# EAGLE design module (EAGLE 9.6.2)
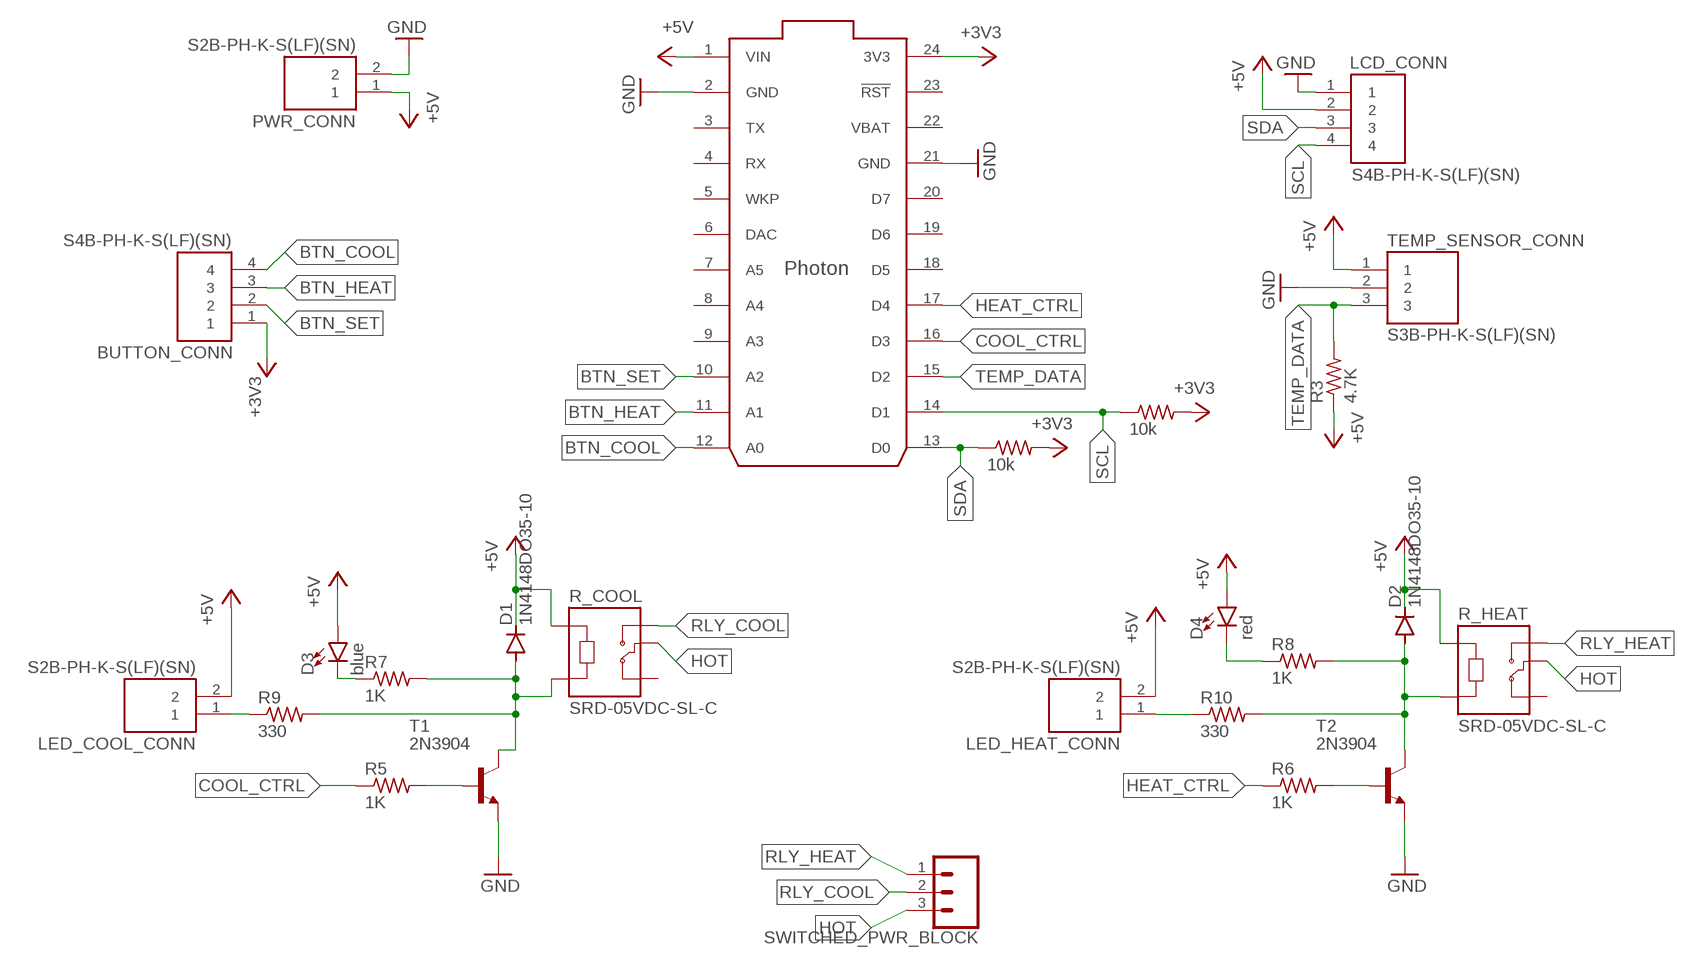
[diagram p0: schematic, sheet 1]

## Parts
BUTTON_CONN  S4B-PH-K-S(LF)(SN)  [JST_S4B-PH-K-S(LF)(SN)]
D1  1N4148DO35-10  [DO35-10]
D2  1N4148DO35-10  [DO35-10]
D3  blue  LED3MM  [LED_3MM]
D4  red  LED3MM  [LED_3MM]
LCD_CONN  S4B-PH-K-S(LF)(SN)  [JST_S4B-PH-K-S(LF)(SN)]
LED_COOL_CONN  S2B-PH-K-S(LF)(SN)  [JST_S2B-PH-K-S(LF)(SN)]
LED_HEAT_CONN  S2B-PH-K-S(LF)(SN)  [JST_S2B-PH-K-S(LF)(SN)]
PWR_CONN  S2B-PH-K-S(LF)(SN)  [JST_S2B-PH-K-S(LF)(SN)]
R1  10k  R-US_0207/10  [0207/10]
R2  10k  R-US_0207/10  [0207/10]
R3  4.7K  R-US_0207/10  [0207/10]
R5  1K  R-US_0207/10  [0207/10]
R6  1K  R-US_0207/10  [0207/10]
R7  1K  R-US_0207/10  [0207/10]
R8  1K  R-US_0207/10  [0207/10]
R9  330  R-US_0207/10  [0207/10]
R10  330  R-US_0207/10  [0207/10]
R_COOL  SRD-05VDC-SL-C  [RELAY_SRD-05VDC-SL-C]
R_HEAT  SRD-05VDC-SL-C  [RELAY_SRD-05VDC-SL-C]
SWITCHED_PWR_BLOCK  CONN_03-SCREW-5MM  [SCREWTERMINAL-5MM-3]
T1  2N3904  [TO92]
T2  2N3904  [TO92]
TEMP_SENSOR_CONN  S3B-PH-K-S(LF)(SN)  [JST_S3B-PH-K-S(LF)(SN)]
U$1  PHOTON_WITH_HEADERS  [PHOTON]

## Nets
+3V3: BUTTON_CONN.1 R1.2 R2.2 U$1.24(3V3)
+5V: D1.C D2.C D3.A D4.A LCD_CONN.2 LED_COOL_CONN.2 LED_HEAT_CONN.2 PWR_CONN.1 R3.1 R_COOL.A1 R_HEAT.A1 TEMP_SENSOR_CONN.1 U$1.1(VIN)
BTN_COOL: BUTTON_CONN.4 U$1.12(A0)
BTN_HEAT: BUTTON_CONN.3 U$1.11(A1)
BTN_SET: BUTTON_CONN.2 U$1.10(A2)
COOL_CTRL: R5.1 U$1.16(D3)
GND: LCD_CONN.1 PWR_CONN.2 T1.3(E) T2.3(E) TEMP_SENSOR_CONN.2 U$1.2(GND) U$1.21(GND)
HEAT_CTRL: R6.1 U$1.17(D4)
HOT [high_pwr]: R_COOL.COM R_HEAT.COM SWITCHED_PWR_BLOCK.3
N$2: LED_COOL_CONN.1 R9.1
N$3: LED_HEAT_CONN.1 R10.1
N$4: D1.A R7.2 R9.2 R_COOL.A2 T1.1(C)
N$5: D3.K(C) R7.1
N$6: R5.2 T1.2(B)
N$8: R6.2 T2.2(B)
N$9: D2.A R8.2 R10.2 R_HEAT.A2 T2.1(C)
N$13: D4.K(C) R8.1
RLY_COOL [high_pwr]: R_COOL.NO SWITCHED_PWR_BLOCK.2
RLY_HEAT [high_pwr]: R_HEAT.NO SWITCHED_PWR_BLOCK.1
SCL: LCD_CONN.4 R1.1 U$1.14(D1)
SDA: LCD_CONN.3 R2.1 U$1.13(D0)
TEMP_DATA: R3.2 TEMP_SENSOR_CONN.3 U$1.15(D2)
Unconnected: R_COOL.NC R_HEAT.NC U$1.3(TX) U$1.4(RX) U$1.5(WKP) U$1.6(DAC) U$1.7(A5) U$1.8(A4) U$1.9(A3) U$1.18(D5) U$1.19(D6) U$1.20(D7) U$1.23(!RST)

## Power pins joined to a net without a drawn wire
VBAT: U$1.22(VBAT)

## Library data of the parts
BUTTON_CONN LCD_CONN = S4B-PH-K-S_LF__SN_:S4B-PH-K-S(LF)(SN): PH Series 4 Position 2 mm Pitch Through Hole Side Entry Shrouded Header Check availability <https://pricing.snapeda.com/parts/S4B-PH-K-S%28LF%29%28SN%29/JST%20Sales/view-part?ref=eda>; AVAILABILITY: In Stock; DESCRIPTION: Connector Header Through Hole, Right Angle 4 position 0.079 (2.00mm); MF: JST (JAPAN SOLDERLESS TERMINALS); MP: S4B-PH-K-S(LF)(SN); MPN: S4B-PH-K-S (LF)(SN); OC_NEWARK: 38K8074; PACKAGE: None; PRICE: None
D1 D2 = diode:1N4148: DIODE high speed (Philips); MF: MULTICOMP PRO; MPN: 1N4148 (DO-35); OC_NEWARK: 05AC0533
D3 = SparkFun-LED:LED: LED (Generic) Standard schematic elements and footprints for 5mm, 3mm, 1206, and 0603 sized LEDs. Generic LEDs with no color specified.; MF: VISHAY; MPN: TLHB4400; OC_NEWARK: 09X0596; PROD_ID: DIO-08794
D4 = SparkFun-LED:LED: LED (Generic) Standard schematic elements and footprints for 5mm, 3mm, 1206, and 0603 sized LEDs. Generic LEDs with no color specified.; MF: VCC (VISUAL COMMUNICATIONS COMPANY); MPN: 4300F1LC; OC_NEWARK: 05C1482; PROD_ID: DIO-08794
LED_COOL_CONN LED_HEAT_CONN PWR_CONN = S2B-PH-K-S_LF__SN_:S2B-PH-K-S(LF)(SN): PH Series 2 Position 2.0 mm Through Hole Side Entry Shrouded Header Check availability <https://pricing.snapeda.com/parts/S2B-PH-K-S%28LF%29%28SN%29/JST%20Sales%20America%20Inc./view-part?ref=eda>; AVAILABILITY: In Stock; DESCRIPTION: Connector Header Through Hole, Right Angle 2 position; MF: JST (JAPAN SOLDERLESS TERMINALS); MP: S2B-PH-K-S(LF)(SN); MPN: S2B-PH-K-S (LF)(SN); OC_NEWARK: 38K8066; PACKAGE: None; PRICE: None
R1-R3 R5-R10 = rcl:R-US_: RESISTOR, American symbol; OC_NEWARK: unknown; SPICEPREFIX: R
R_COOL R_HEAT = SRD-05VDC-SL-C:SRD-05VDC-SL-C: 5V Trigger Relay Module For Arduino And Raspberry Pi 5V Trigger Relay Module For Arduino And Raspberry Pi Check availability <https://pricing.snapeda.com/parts/SRD-05VDC-SL-C/Songle%20Relay/view-part?ref=eda>; AVAILABILITY: Not in stock; DESCRIPTION: 5V Trigger Relay Module For Arduino And Raspberry Pi 5V Trigger Relay Module For Arduino And Raspberry Pi; MP: SRD-05VDC-SL-C; OC_NEWARK: unknown; PACKAGE: None; PRICE: None
SWITCHED_PWR_BLOCK = SparkFun-Connectors:CONN_03: Multi connection point. Often used as Generic Header-pin footprint for 0.1 inch spaced/style header connections On any of the 0.1 inch spaced packages, you can populate with these: Break Away Headers - Straight <https://www.sparkfun.com/products/116> (PRT-00116) Break Away Male Headers - Right Angle <https://www.sparkfun.com/products/553> (PRT-00553) Female Headers <https://www.sparkfun.com/products/115> (PRT-00115) Break Away Headers - Machine Pin <https://www.sparkfun.com/products/117> (PRT-00117) Break Away Female Headers - Swiss Machine Pin <https://www.sparkfun.com/products/743> (PRT-00743) Stackable Header - 3 Pin (Female, 0.1") <https://www.sparkfun.com/products/13875> (PRT-13875) For SCREWTERMINALS and SPRING TERMINALS visit here: Screw Terimnals on SparkFun.com <https://www.sparkfun.com/search/results?term=Screw+Terminals> (5mm/3.5mm/2.54mm spacing) This device is also useful as a general connection point to wire up your design to another part of your project. Our various solder wires solder well into these plated through hole pads. Hook-Up Wire - Assortment (Stranded, 22 AWG) <https://www.sparkfun.com/products/11375> (PRT-11375) Hook-Up Wire - Assortment (Solid Core, 22 AWG) <https://www.sparkfun.com/products/11367> (PRT-11367) View the entire wire category on our website here <https://www.sparkfun.com/categories/141> Special notes: Molex polarized connector foot print use with SKU : PRT-08232 with associated crimp pins and housings.; OC_NEWARK: unknown; PROD_ID: CONN-10134; SF_SKU: PRT-08433
T1 T2 = transistor:2N3904: NPN TRANSISTOR; MF: ONSEMI; MPN: 2N3904TF; OC_NEWARK: 05R0381
TEMP_SENSOR_CONN = S3B-PH-K-S_LF__SN_:S3B-PH-K-S(LF)(SN): Connector Header Through Hole, Right Angle 3 position 0.079" (2.00mm); DESCRIPTION: Connector Header Through Hole, Right Angle 3 position 0.079 (2.00mm); DIGI-KEY_PART_NUMBER: 455-1720-ND; MF: JST (JAPAN SOLDERLESS TERMINALS); MP: S3B-PH-K-S(LF)(SN); MPN: S3B-PH-K-S (LF)(SN); OC_NEWARK: 38K8070; PACKAGE: None
U$1 = Particle-Devices:PHOTON: Particle Photon Wi-Fi through-hole development board footprint Product datasheet: here <https://docs.particle.io/datasheets/photon-(wifi)/photon-datasheet/> Design files: here <https://github.com/particle-iot/photon> Github : Particle devices library <https://github.com/particle-iot/hardware-libraries/tree/master/Eagle>; MF: PARTICLE; MPN: PHOTONH; OC_NEWARK: 60AC3758

## Net classes
0 default: width 0.305 mm, drill 0.61 mm, clearance 0.254 mm
1 high_pwr: width 1.524 mm, drill 1.27 mm, clearance 1.016 mm

## Board
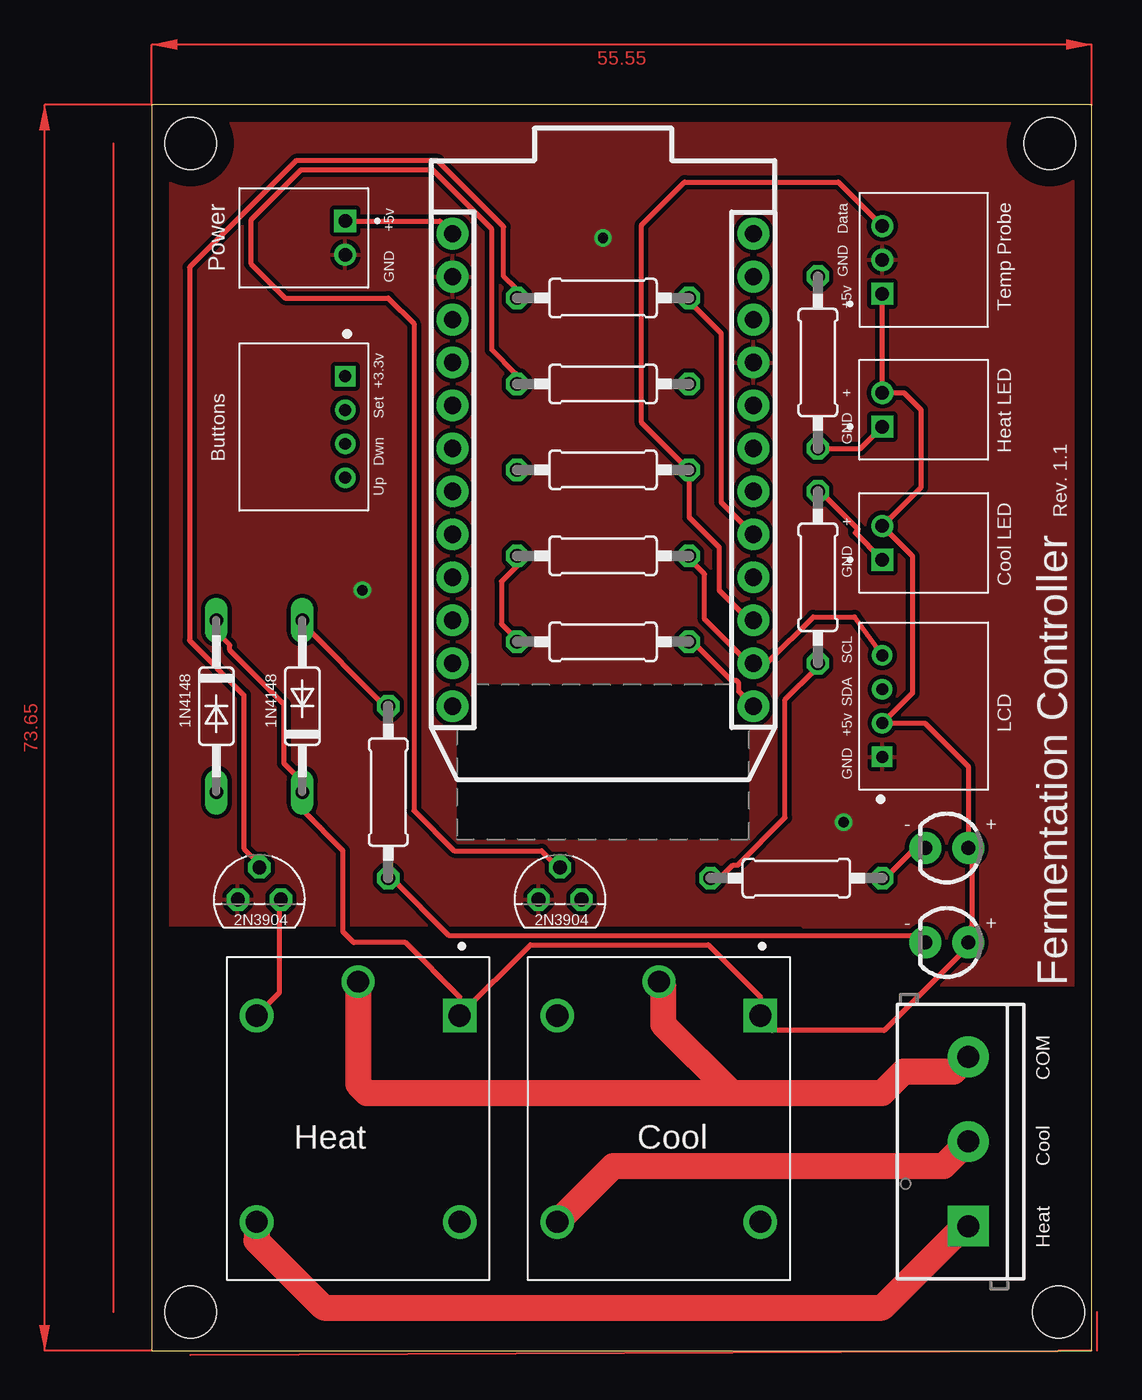
[diagram p1: board, top side]
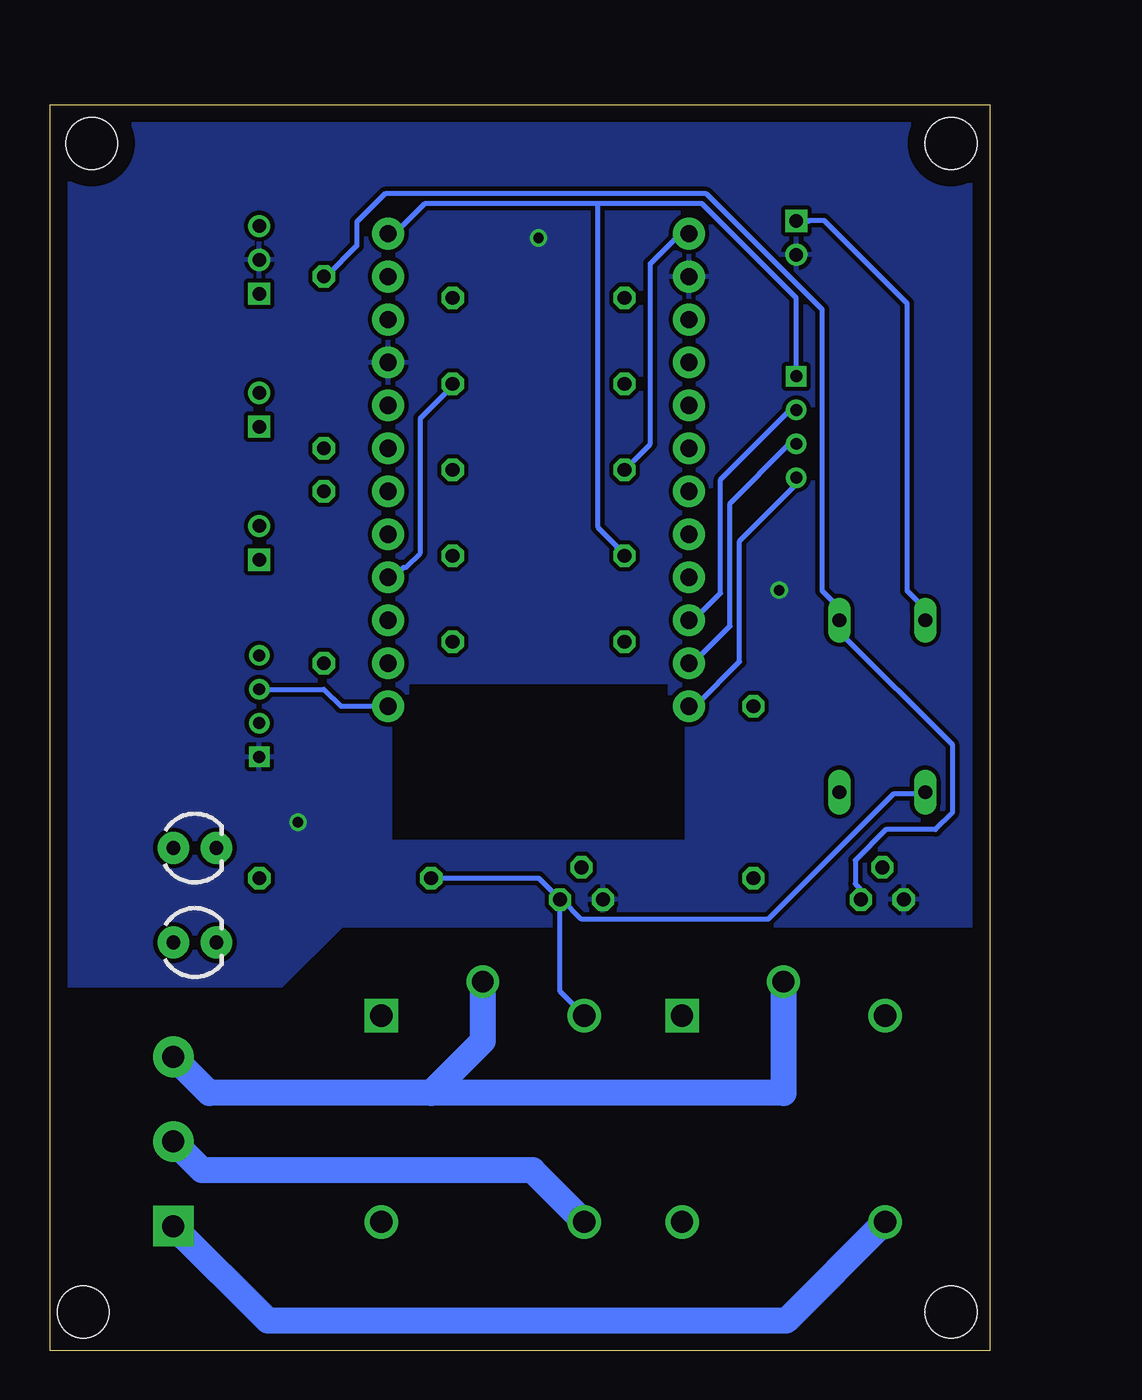
[diagram p2: board, bottom side, seen from below]

Size 55.55 x 73.65 mm. Coordinates in mm from the lower left corner, seen from the top.
Outline: 0,0 55.55,0 55.55,73.65 0,73.65 0,0
Copper layers (1*16): Top 0.035mm / dielectric 1.5mm / Bottom 0.035mm
Design rules "default": minimum track width 6mil, minimum drill 0.35mm, track to track 6mil, track to pad 6mil, pad to pad 6mil, via to via 6mil, smd to smd 6mil, copper to edge 40mil, drill to drill 6mil, minimum pad ring 10mil, minimum via ring 8mil, stop-mask expansion 4mil, vias tented up to drill 0mil, thermal gap 10mil
Holes 3.05 mm at 2.29,71.37 53.09,71.37 53.59,2.29 2.29,2.29

### Footprints (pad centres in the part's own frame; a part is rotated, then mirrored left to right if it is on the bottom)
JST_S4B-PH-K-S(LF)(SN) = drill 0.7 square: 1 -3,0 | drill 0.7: 2 -1,0; 3 1,0; 4 3,0
DO35-10 = drill 0.813 long: A 5.08,0; C -5.08,0
LED_3MM = drill 0.813 pad 1.88: A -1.27,0; K 1.27,0
JST_S2B-PH-K-S(LF)(SN) = drill 0.8 square: 1 -1,0 | drill 0.8: 2 1,0
0207/10 = drill 0.813 octagon: 1 -5.08,0; 2 5.08,0
RELAY_SRD-05VDC-SL-C = drill 1.32 square: A1 -6.1,6 | drill 1.32: A2 -6.1,-6; NC 6.1,6; NO 6.1,-6 | drill 1.29: COM -8.1,0
SCREWTERMINAL-5MM-3 = drill 1.3 pad 2.413 square: 1 0,0 | drill 1.3 pad 2.413: 2 5,0; 3 10,0
TO92 = drill 0.813 octagon: 1 1.27,0; 2 0,1.905; 3 -1.27,0
JST_S3B-PH-K-S(LF)(SN) = drill 0.8 square: 1 0,0 | drill 0.8: 2 2,0; 3 4,0
PHOTON = drill 1.016 pad 1.88: 1 1.27,33.02; 2 1.27,30.48; 3 1.27,27.94; 4 1.27,25.4; 5 1.27,22.86; 6 1.27,20.32; 7 1.27,17.78; 8 1.27,15.24; 9 1.27,12.7; 10 1.27,10.16; 11 1.27,7.62; 12 1.27,5.08; 13 19.05,5.08; 14 19.05,7.62; 15 19.05,10.16; 16 19.05,12.7; 17 19.05,15.24; 18 19.05,17.78; 19 19.05,20.32; 20 19.05,22.86; 21 19.05,25.4; 22 19.05,27.94; 23 19.05,30.48; 24 19.05,33.02

### Placement (x,y rotation side)
BUTTON_CONN  11.43,54.61 270 top
D1  3.81,38.1 270 top
D2  8.89,38.1 90 top
D3  46.99,29.72 180 top
D4  46.99,24.13 180 top
LCD_CONN  43.18,38.1 90 top
LED_COOL_CONN  43.18,47.75 90 top
LED_HEAT_CONN  43.18,55.63 90 top
PWR_CONN  11.43,65.79 270 top
R1  26.67,46.99 180 top
R2  26.67,41.91 180 top
R3  26.67,52.07 0 top
R5  26.67,57.15 180 top
R6  26.67,62.23 180 top
R7  38.1,27.94 180 top
R8  13.97,33.02 90 top
R9  39.37,45.72 270 top
R10  39.37,58.42 90 top
R_COOL  29.97,13.72 270 top
R_HEAT  12.19,13.72 270 top
SWITCHED_PWR_BLOCK  48.26,7.37 90 top
T1  24.13,26.67 0 top
T2  6.35,26.67 0 top
TEMP_SENSOR_CONN  43.18,62.48 90 top
U$1  16.51,33.02 0 top

### Tracks (layer width: path | path; a pad name or v marks a point on that pad's centre or on a via)
+3V3
  Top 0.305: R2.2 21.5,41.99 21.5,42.13 20.66,42.96 20.66,45.48 21.64,46.46 21.64,46.88 R1.2
  Bottom 0.305: 23.18,67.83 33.38,67.83 35.05,66.15 35.47,66.15 U$1.24 | 23.18,67.83 17.03,67.83 11.44,62.24 11.44,57.63 BUTTON_CONN.1 | 23.18,67.83 23.18,48.69 22.06,47.57 22.06,47.43 21.64,47.02 R1.2
+5V
  Top 0.305: D1.C 3.9,43.1 3.9,42.41 4.6,41.71 4.6,41.43 7.81,38.21 7.81,34.72 8.79,33.74 8.79,33.05 D2.C 8.93,32.91 8.93,31.93 11.3,29.55 11.3,24.77 11.94,24.13 14.99,24.13 18.19,20.92 R_HEAT.A1 22.38,24 32.89,24 35.97,20.92 R_COOL.A1 36.68,18.94 43.29,18.94 48.18,23.82 48.18,24.11 D4.A 48.32,24.24 48.32,24.94 48.46,25.08 48.46,29.55 48.32,29.69 48.3,29.68 D3.A 48.18,29.77 48.26,29.84 48.26,34.54 45.7,37.1 LCD_CONN.2 44.96,38.88 44.96,46.97 LED_COOL_CONN.2 45.47,51.04 45.47,55.63 44.47,56.63 LED_HEAT_CONN.2 TEMP_SENSOR_CONN.1 | PWR_CONN.1 17.03,66.79 U$1.1
  Bottom 0.305: D1.C 3.9,43.24 3.9,43.94 4.88,44.92 4.88,61.9 9.78,66.8 10.67,66.8 10.68,66.79 PWR_CONN.1 | R3.1 20.07,53.59 20.07,64.26 18.29,66.04 U$1.1
BTN_COOL
  Bottom 0.305: BUTTON_CONN.4 11.44,51.49 11.44,51.21 14.8,47.85 14.8,40.73 17.31,38.21 17.73,38.21 U$1.12
BTN_HEAT
  Bottom 0.305: BUTTON_CONN.3 11.44,53.58 11.86,53.58 15.35,50.09 15.35,42.82 17.45,40.73 17.73,40.73 U$1.11
BTN_SET
  Bottom 0.305: BUTTON_CONN.2 11.44,55.54 11.86,55.54 15.91,51.49 15.91,44.78 17.45,43.24 17.73,43.24 U$1.10
COOL_CTRL
  Bottom 0.305: R5.1 31.84,57.07 31.84,56.93 33.66,55.12 33.66,47.16 34.49,46.32 34.63,46.32 35.19,45.76 35.47,45.76 U$1.16
GND  (via drill 0.61)
  other vias: 26.67,65.79 40.89,31.24 12.45,44.96
  pour Top: -1.27,73.66 -1.27,26.67 0.25,25.15 38.35,25.15 41.91,21.59 57.15,21.59 57.15,73.66 55.88,74.93 0,74.93
  pour Bottom: -0.76,73.91 -0.76,26.16 0.25,25.15 38.35,25.15 41.91,21.59 57.15,21.59 57.15,74.42 56.13,75.44 0.76,75.44
HEAT_CTRL
  Top 0.305: R6.1 31.84,62.1 31.84,61.96 33.66,60.15 33.66,50.16 U$1.17
HOT
  Top 1.524: R_HEAT.COM 12.19,15.75 12.7,15.24 34.29,15.24 | SWITCHED_PWR_BLOCK.3 47.4,16.51 44.45,16.51 43.18,15.24 34.29,15.24 | R_COOL.COM 30.23,21.56 30.23,19.3 34.29,15.24
  Bottom 1.524: R_HEAT.COM 12.19,15.24 33.02,15.24 | SWITCHED_PWR_BLOCK.3 46.13,15.24 33.02,15.24 | R_COOL.COM 29.97,18.29 33.02,15.24
N$2
  Top 0.305: LED_COOL_CONN.1 41.58,48.35 41.76,48.55 39.38,50.93 R9.1
N$3
  Top 0.305: R10.1 39.38,53.3 41.86,53.3 LED_HEAT_CONN.1
N$4
  Top 0.305: R9.2 39.24,40.59 39.24,40.31 37.43,38.49 37.43,31.51 34.63,28.71 34.35,28.71 33.66,28.02 33.1,28.02 R7.2
  Bottom 0.305: D1.A 3.9,32.91 5.7,32.91 13.11,25.5 24.13,25.5 25.3,26.67 T1.1 | R7.2 26.67,27.94 T1.1 | R_COOL.A2 25.4,21.24 T1.1
N$5
  Top 0.305: R7.1 43.29,28.02 43.43,28.02 44.97,29.55 45.55,29.55 D3.K
N$6
  Top 0.305: T1.2 24.02,28.57 23.04,29.55 17.87,29.55 15.49,31.93 15.49,60.71 13.97,62.23 7.87,62.23 5.84,64.26 5.84,66.83 8.8,69.79 16.61,69.79 20.1,66.29 20.1,59.17 21.5,57.77 21.5,57.21 R5.2
N$8
  Top 0.305: T2.2 6.27,28.57 6.27,28.85 5.44,29.69 5.44,38.77 2.22,41.99 2.22,64.05 8.52,70.34 16.89,70.34 20.8,66.43 20.8,63.5 21.5,62.8 21.5,62.24 R6.2
N$9
  Top 0.305: T2.1 7.53,26.62 7.53,21.16 R_HEAT.A2 | R8.2 13.96,38.21 13.68,38.21 8.79,43.1 D2.A
  Bottom 0.305: R10.2 39.24,63.5 37.43,65.32 37.43,66.71 35.75,68.39 16.75,68.39 9.91,61.54 9.91,44.92 8.93,43.94 8.93,43.24 D2.A 8.79,43.1 8.79,42.41 2.22,35.84 2.22,31.79 3.2,30.81 6.13,30.81 7.95,28.99 7.95,27.6 7.67,27.32 7.67,26.76 T2.1
N$13
  Top 0.305: R8.1 14.1,27.88 14.24,27.88 17.55,24.56 45.21,24.56 45.67,24.11 D4.K
RLY_COOL
  Top 1.524: R_COOL.NO 27.28,10.92 46.82,10.92 SWITCHED_PWR_BLOCK.2
  Bottom 1.524: R_COOL.NO 27.02,10.67 46.56,10.67 SWITCHED_PWR_BLOCK.2
RLY_HEAT
  Top 1.524: R_HEAT.NO 6.19,6.51 10.16,2.54 43.18,2.54 48.01,7.37 SWITCHED_PWR_BLOCK.1
  Bottom 1.524: R_HEAT.NO 12.03,1.78 42.67,1.78 SWITCHED_PWR_BLOCK.1
SCL
  Top 0.305: LCD_CONN.4 41.54,43.38 39.1,43.38 36.45,40.73 35.61,40.73 U$1.14 35.47,40.73 35.19,40.73 32.68,43.24 32.68,45.9 31.84,46.74 31.84,46.88 R1.1
SDA
  Top 0.305: U$1.13 34.7,38.96 34.7,39.47 34.54,39.62 34.25,39.62 31.97,41.91 R2.1
  Bottom 0.305: LCD_CONN.3 39.35,39.1 38.35,38.1 U$1.13
TEMP_DATA
  Top 0.305: U$1.15 35.31,43.18 33.53,44.96 33.53,47.5 31.75,49.28 R3.2 28.96,54.86 28.96,66.55 31.5,69.09 40.58,69.09 TEMP_SENSOR_CONN.3
(copper drawn outside any net)
  shapes: Top area x7

### Text on the board
tPlace: Power | +5v | Data | GND | GND | +5v | Temp Probe | +3.3v | + | Set | GND | Buttons | Heat LED | Dwn | Up | + | Rev. 1.1 | GND | Cool LED | SCL | SDA | 1N4148 | 1N4148 | LCD | +5v | GND | - | + | 2N3904 | 2N3904 | - | + | Fermentation Controller | COM | Heat | Cool | Cool | Heat